# EAGLE schematic atmelModule (EAGLE 6.4)
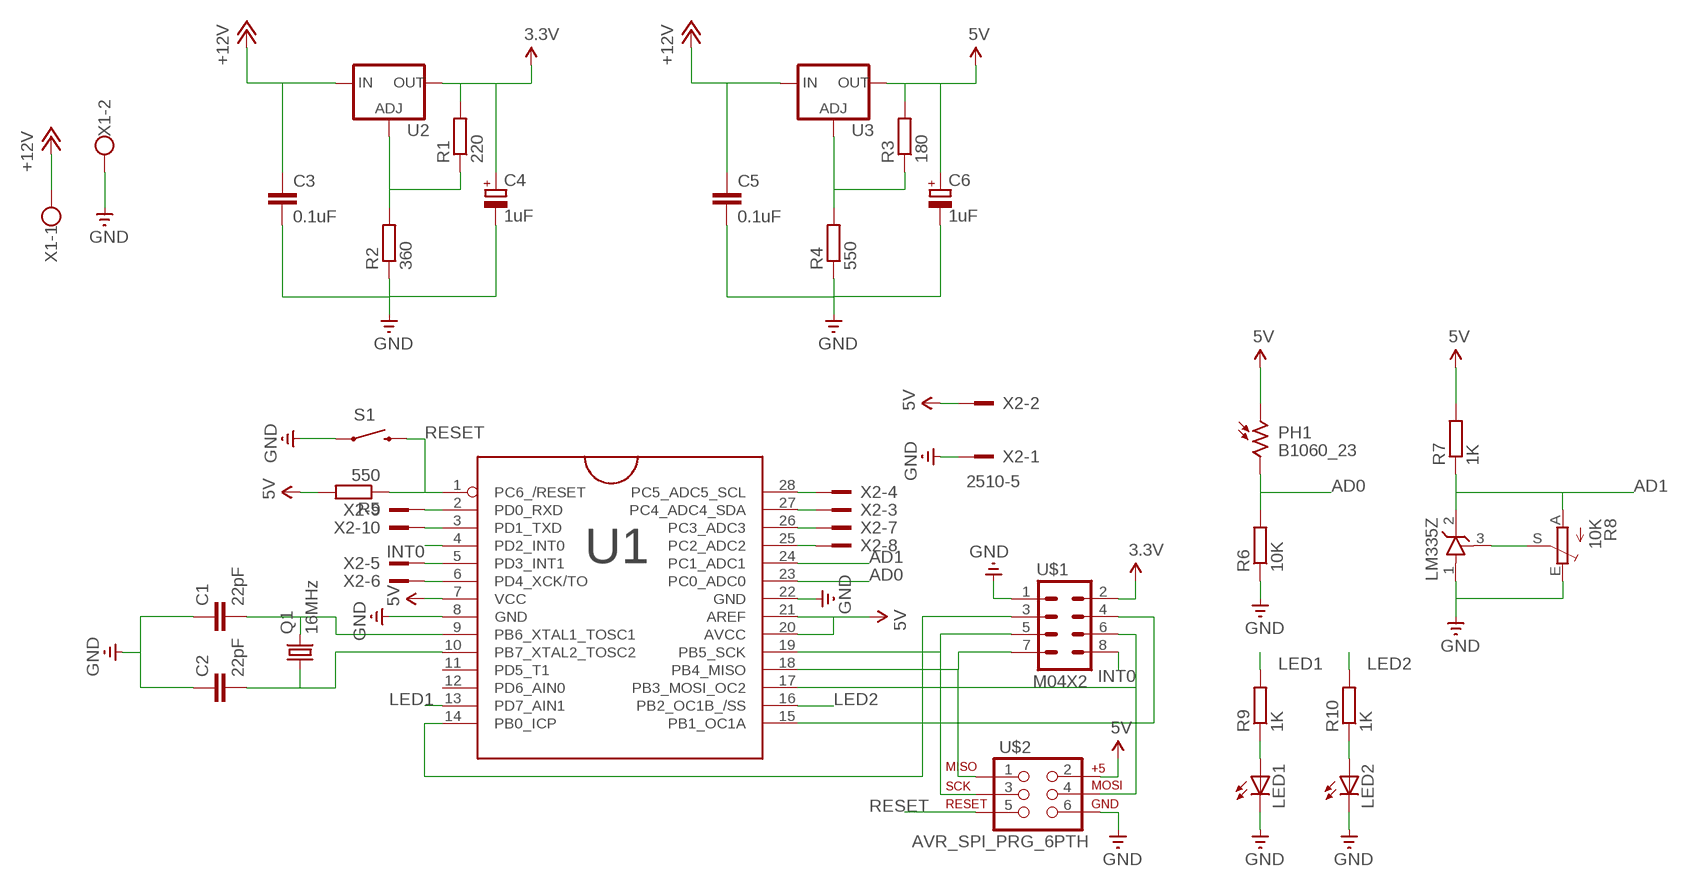
[diagram p0: schematic, sheet 1]

## Parts
C1  22pF  CAPPTH2  [CAP-PTH-SMALL2]
C2  22pF  CAPPTH2  [CAP-PTH-SMALL2]
C3  0.1uF  CAPPTH2  [CAP-PTH-SMALL2]
C4  1uF  CPOL-EUE1.8-4  [E1,8-4]
C5  0.1uF  CAPPTH2  [CAP-PTH-SMALL2]
C6  1uF  CPOL-EUE1.8-4  [E1,8-4]
IC1  LT1009CZ  [TO92]
LED1  LED5MM  [LED5MM]
LED2  LED5MM  [LED5MM]
PH1  B1060_23  [TO-8_B10]
Q1  16MHz  CRYTALHC49U-V  [HC49U-V]
R1  220  R-EU_0207/7  [0207/7]
R2  360  R-EU_0207/7  [0207/7]
R3  180  R-EU_0207/7  [0207/7]
R4  550  R-EU_0207/7  [0207/7]
R5  550  R-EU_0207/7  [0207/7]
R6  10K  R-EU_0207/7  [0207/7]
R7  1K  R-EU_0207/7  [0207/7]
R8  10K  TRIM_EU-RJ9W  [RJ9W]
R9  1K  R-EU_0207/7  [0207/7]
R10  1K  R-EU_0207/7  [0207/7]
S1  SWITCH-MOMENTARY-2PTH  [TACTILE-PTH]
U1  ATMEGA8_PDIP28_PDIP  [DIL-28-3]
U2  V_REG_317SINK  [TO220-ADJ]
U3  V_REG_317SINK  [TO220-ADJ]
U$1  M04X2  [2X4]
U$2  AVR_SPI_PRG_6PTH  [2X3]
X1  W237-102  [W237-102]
X2  2510-5  [PAK100/2500-5-10]

## Nets
3.3V: C4.+ R1.2 U2.OUT U$1.2
5V: C6.+ PH1.1 R3.2 R5.2 R7.2 U1.7(VCC) U1.20(AVCC) U1.21(AREF) U3.OUT U$2.2 X2.2
+12V: C3.1 C5.1 U2.IN U3.IN X1.1
AD0: PH1.2 R6.2 U1.23(PC0_ADC0)
AD1: IC1.2(C) R7.1 R8.A U1.24(PC1_ADC1)
GND: C1.1 C2.1 C3.2 C4.- C5.2 C6.- IC1.1(A) LED1.K(C) LED2.K(C) R2.1 R4.1 R6.1 R8.E S1.1 U1.8(GND) U1.22(GND) U$1.1 U$2.6 X1.2 X2.1
INT0: U1.4(PD2_INT0) U$1.8
LED1: R9.2 U1.13(PD7_AIN1)
LED2: R10.2 U1.16(PB2_OC1B_/SS)
N$1: C1.2 Q1.2 U1.9(PB6_XTAL1_TOSC1)
N$2: C2.2 Q1.1 U1.10(PB7_XTAL2_TOSC2)
N$3: R3.1 R4.2 U3.ADJ
N$4: U1.14(PB0_ICP) U$1.3
N$5: U1.15(PB1_OC1A) U$1.4
N$6: U1.19(PB5_SCK) U$1.5 U$2.3
N$7: R1.1 R2.2 U2.ADJ
N$8: U1.17(PB3_MOSI_OC2) U$1.6 U$2.4
N$9: U1.18(PB4_MISO) U$1.7 U$2.1
N$10: LED1.A R9.1
N$11: LED2.A R10.1
N$12: U1.3(PD1_TXD) X2.10
N$13: U1.5(PD3_INT1) X2.5
N$14: IC1.3(R) R8.S
N$15: U1.6(PD4_XCK/TO) X2.6
N$16: U1.26(PC3_ADC3) X2.7
N$17: U1.25(PC2_ADC2) X2.8
N$18: U1.2(PD0_RXD) X2.9
N$21: U1.27(PC4_ADC4_SDA) X2.3
N$22: U1.28(PC5_ADC5_SCL) X2.4
RESET: R5.1 S1.3 U1.1(PC6_/RESET) U$2.5
Unconnected: U1.11(PD5_T1) U1.12(PD6_AIN0)

## Notes on the sheet
- LM335Z

## Library data of the parts
C1-C3 C5 = SparkFun-Capacitors:CAP: Capacitor Standard 0603 ceramic capacitor, and 0.1" leaded capacitor.
C4 C6 = qfm-trx1-24g:CPOL-EU: POLARIZED CAPACITOR, European symbol
IC1 = linear-technology-2:LT1009*Z: Voltage Reference 2.5V TO92 package
LED1 LED2 = SparkFun:LED: LEDs Standard schematic elements and footprints for 5mm, 3mm, 1206, and 0603 sized LEDs. 5mm - Spark Fun Electronics SKU : COM-00529 (and others)
PH1 = photo-elements:?1060*: Sensor Street Light control Source: http://optoelectronics.perkinelmer.com/content/Datasheets/DTS_PhotocellsB1060.pdf
Q1 = crystal:CRYTAL: CRYSTAL
R1-R7 R9 R10 = rcl:R-EU_: RESISTOR, European symbol
R8 = pot:TRIM_EU-: POTENTIOMETER
S1 = SparkFun-Electromechanical:SWITCH-MOMENTARY-2: Various NO switches- pushbuttons, reed, etc
U1 = atmel_prototype_header:ATMEGA8_PDIP28: ATMEL 8-bit AVR Microcontroller with 8K Bytes In-System Programmable Flash.
U2 U3 = SparkFun-PowerIC:V_REG_317: Voltage Regulator Standard LM317 adjustable voltage regulator. AOI (Adjust Output Input). Google 'LM317 Calculator' for easy to use app to get the two resistor values needed. 240/720 for 5V output. 240/390 for 3.3V output. Spark Fun Electronics SKU : COM-00527
U$1 = SparkFun-Connectors:M04X2: .1" header, two rows of four.
U$2 = SparkFun:AVR_SPI_PRG_6: AVR ISP 6 Pin This is the reduced ISP connector for AVR programming. Common on Arduino. This footprint will take up less PCB space and can be used with a 10-pin to 6-pin adapter such as SKU: BOB-08508
X1 = con-wago-500:W237-102: WAGO SCREW CLAMP; MPN: 237-102; OC_FARNELL: unknown; OC_NEWARK: 70K9898
X2 = con-3m:2510-: 3M (TM) Pak 100 4-Wall Header Source: 3M; OC_FARNELL: 1788669; OC_NEWARK: unknown